# EAGLE design HH-08MX (EAGLE 7.5.0)
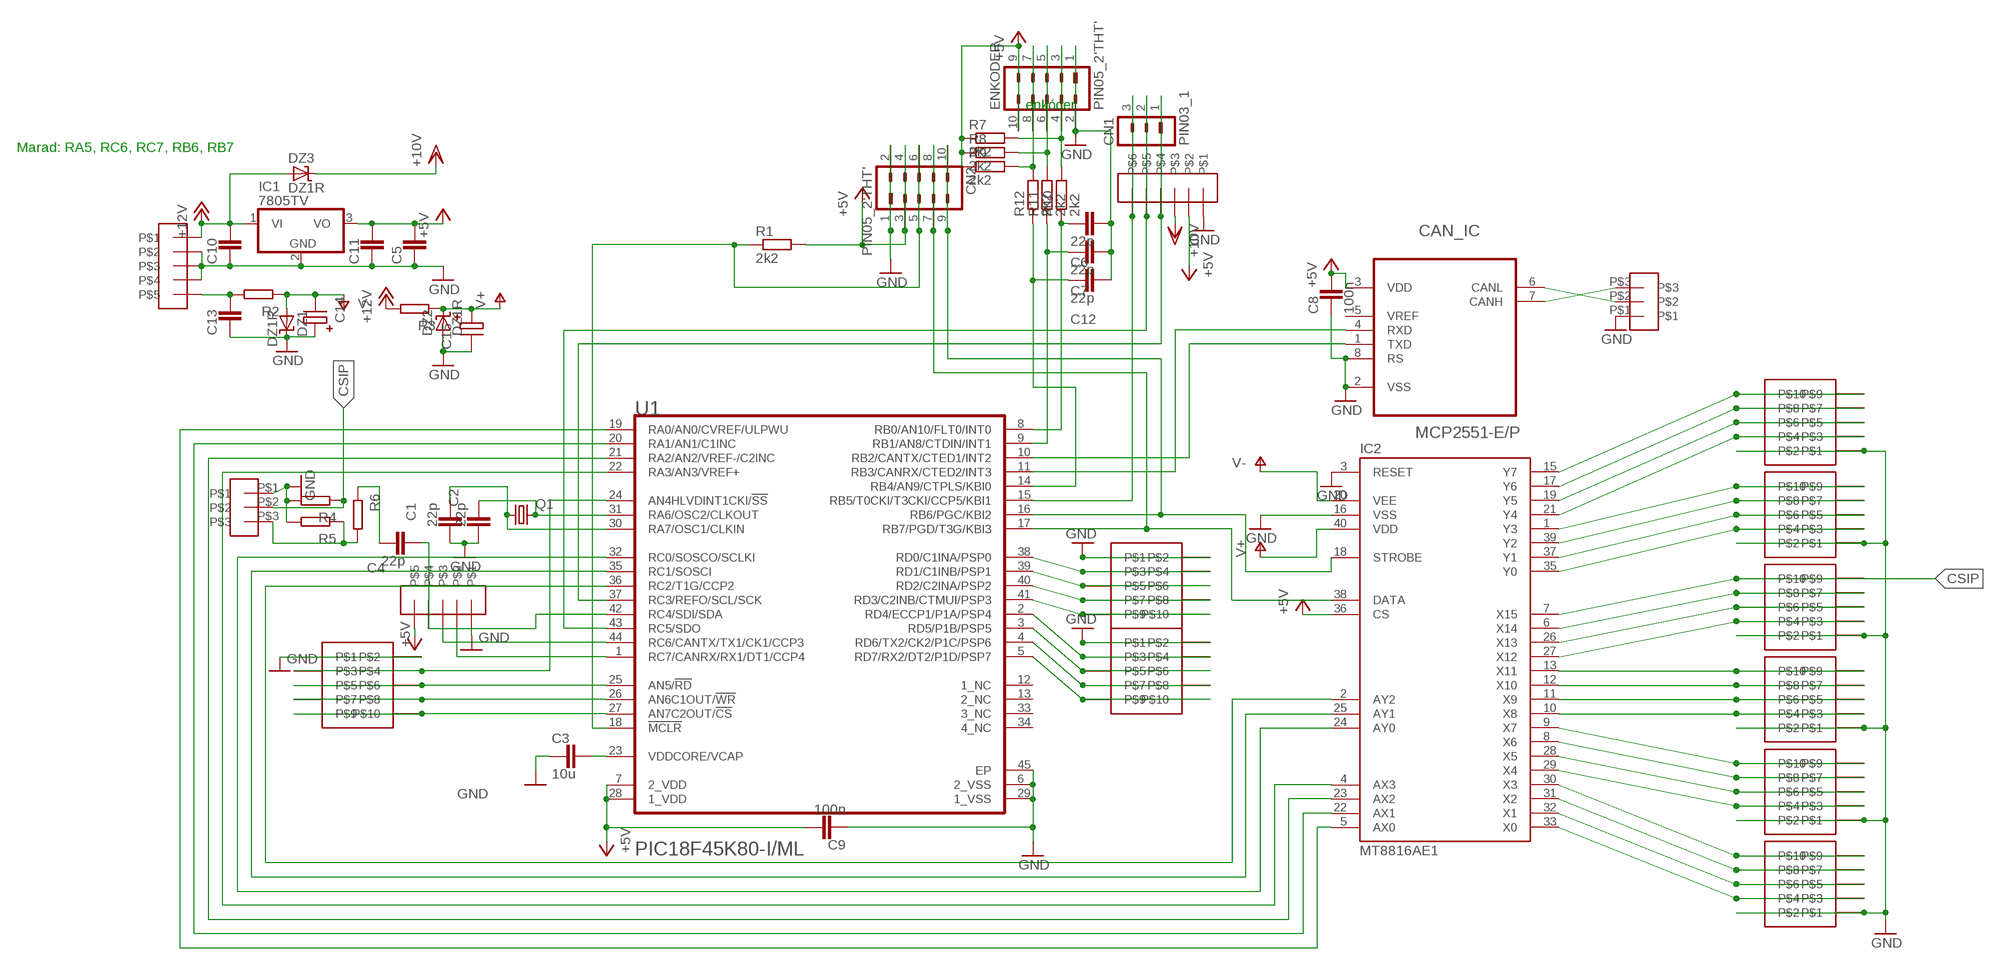
[diagram p0: schematic, sheet 1]

## Parts
BE1-4  KERETES_TUS_10  [KERETES_TUS_10]
BE5-8  KERETES_TUS_10  [KERETES_TUS_10]
BE9-12  KERETES_TUS_10  [KERETES_TUS_10]
BE13-16  KERETES_TUS_10  [KERETES_TUS_10]
C1  22p  C0805_NAGY  [R_0805_NAGY]
C2  22p  C0805_NAGY  [R_0805_NAGY]
C3  10u  C0805_NAGY  [R_0805_NAGY]
C4  22p  C0805_NAGY  [R_0805_NAGY]
C5  C0805_NAGY  [R_0805_NAGY]
C6  22p  C0805_NAGY  [R_0805_NAGY]
C7  22p  C0805_NAGY  [R_0805_NAGY]
C8  100n  C0805_NAGY  [R_0805_NAGY]
C9  100n  C0805_NAGY  [R_0805_NAGY]
C10  C0805_NAGY  [R_0805_NAGY]
C11  C0805_NAGY  [R_0805_NAGY]
C12  22p  C0805_NAGY  [R_0805_NAGY]
C13  C0805_NAGY  [R_0805_NAGY]
C14  C_EL1R06  [C_EL1RASZT06]
C15  C_EL1R06  [C_EL1RASZT06]
CAN_IC  MCP2551-E/P  [DIP254P762X432-8]
CN1  PIN03_1  [PIN03_1]
CN2  PIN05_2'THT'  [PIN05_2]
DZ1  DZ1R  [D1RASZT]
DZ2  DZ1R  [D1RASZT]
DZ3  DZ1R  [D1RASZT]
ENKODER  PIN05_2'THT'  [PIN05_2]
IC1  7805TV  [TO220V]
IC2  MT8816AE1  [DIL40]
KI1-4  KERETES_TUS_10  [KERETES_TUS_10]
KI5-8  KERETES_TUS_10  [KERETES_TUS_10]
KIJELZO  FEHER_TUS_6  [FEHER_TUS_6]
Q1  XTAL_2QS  [XTAL_QS]
R1  2k2  R-EU_R0805  [R0805]
R2  R_EU0805_NAGY  [R_0805_NAGY]
R3  R_EU0805_NAGY  [R_0805_NAGY]
R4  R_EU0805_NAGY  [R_0805_NAGY]
R5  R_EU0805_NAGY  [R_0805_NAGY]
R6  R_EU0805_NAGY  [R_0805_NAGY]
R7  2k2  R-EU_R0805  [R0805]
R8  2k2  R-EU_R0805  [R0805]
R9  2k2  R-EU_R0805  [R0805]
R10  2k2  R-EU_R0805  [R0805]
R11  2k2  R-EU_R0805  [R0805]
R12  2k2  R-EU_R0805  [R0805]
SOROSPORT  FEHER_TUS_5  [FEHER_TUS_5]
U1  MICROCHIP_PIC18F45K80-I-MLMICROCHIP_PIC18F45K80-I-ML_0_2  [MICROCHIP_PIC18F45K80-I-ML_2]
U$1  FEHER_TUS_3  [FEHER_TUS_3]
U$4  FEHER_TUS_3  [FEHER_TUS_3]
U$5  FEHER_TUS_5  [FEHER_TUS_5]
U$14  KERETES_TUS_10  [KERETES_TUS_10]
U$15  KERETES_TUS_10  [KERETES_TUS_10]
U$16  KERETES_TUS_10  [KERETES_TUS_10]

## Nets
+5V: C5.1 C8.1 C9.1 C11.1 CAN_IC.3(VDD) CN2.3 CN2.4 ENKODER.9 ENKODER.10 IC1.3(VO) IC2.36(CS) KIJELZO.P$2 R1.2 R7.1 R8.1 R9.1 SOROSPORT.P$5 U1.7(2_VDD) U1.28(1_VDD)
+12V: C10.1 DZ3.P$1(A) IC1.1(VI) R3.2(E) U$5.P$1
CSIP: BE13-16.P$9 BE13-16.P$10 IC2.7(X15) R4.1(A) U$1.P$2
GND: BE1-4.P$1 BE1-4.P$2 BE5-8.P$1 BE5-8.P$2 BE9-12.P$1 BE9-12.P$2 BE13-16.P$1 BE13-16.P$2 C1.1 C2.1 C3.2 C5.2 C6.1 C7.1 C8.2 C9.2 C10.2 C11.2 C12.1 C13.2 C14.P+ C15.P- CAN_IC.2(VSS) CAN_IC.8(RS) CN2.1 CN2.2 DZ1.P$2(C) DZ2.P$1(A) ENKODER.1 ENKODER.2 IC1.2(GND) IC2.3(RESET) IC2.16(VSS) KI1-4.P$1 KI1-4.P$2 KI5-8.P$1 KI5-8.P$2 KIJELZO.P$1 R4.2(E) R5.2(E) SOROSPORT.P$1 U1.6(2_VSS) U1.29(1_VSS) U1.45(EP) U$1.P$1 U$4.P$1 U$5.P$2 U$5.P$3 U$5.P$4 U$14.P$1 U$14.P$2 U$15.P$1 U$15.P$2 U$16.P$1 U$16.P$2
N$1: CN2.5 CN2.6 R1.1 U1.18(!MCLR!)
N$2: CN1.1 KIJELZO.P$4 U1.37(RC3/REFO/SCL/SCK)
N$3: CN2.9 CN2.10 IC2.18(STROBE) U1.16(RB6/PGC/KBI2)
N$4: C12.2 R12.1 U1.14(RB4/AN9/CTPLS/KBI0)
N$5: CAN_IC.1(TXD) U1.10(RB2/CANTX/CTED1/INT2)
N$6: C7.2 R11.1 U1.9(RB1/AN8/CTDIN/INT1)
N$7: CAN_IC.7(CANH) U$4.P$3
N$8: CAN_IC.6(CANL) U$4.P$2
N$9: IC2.15(Y7) KI5-8.P$9 KI5-8.P$10
N$10: C2.2 Q1.2 U1.31(RA6/OSC2/CLKOUT)
N$11: C1.2 Q1.1 U1.30(RA7/OSC1/CLKIN)
N$12: IC2.17(Y6) KI5-8.P$7 KI5-8.P$8
N$13: IC2.19(Y5) KI5-8.P$5 KI5-8.P$6
N$14: CAN_IC.4(RXD) U1.11(RB3/CANRX/CTED2/INT3)
N$15: C3.1 U1.23(VDDCORE/VCAP)
N$16: C6.2 R10.1 U1.8(RB0/AN10/FLT0/INT0)
N$17: IC2.21(Y4) KI5-8.P$3 KI5-8.P$4
N$18: CN1.2 KIJELZO.P$5 U1.43(RC5/SDO)
N$19: CN1.3 KIJELZO.P$6 U1.15(RB5/T0CKI/T3CKI/CCP5/KBI1)
N$20: U1.38(RD0/C1INA/PSP0) U$14.P$3 U$14.P$4
N$21: CN2.7 CN2.8 IC2.38(DATA) U1.17(RB7/PGD/T3G/KBI3)
N$22: U1.39(RD1/C1INB/PSP1) U$14.P$5 U$14.P$6
N$23: C13.1 R2.2(E) U$5.P$5
N$24: U1.40(RD2/C2INA/PSP2) U$14.P$7 U$14.P$8
N$25: U1.41(RD3/C2INB/CTMUI/PSP3) U$14.P$9 U$14.P$10
N$26: U1.2(RD4/ECCP1/P1A/PSP4) U$15.P$3 U$15.P$4
N$27: U1.3(RD5/P1B/PSP5) U$15.P$5 U$15.P$6
N$28: U1.4(RD6/TX2/CK2/P1C/PSP6) U$15.P$7 U$15.P$8
N$29: U1.5(RD7/RX2/DT2/P1D/PSP7) U$15.P$9 U$15.P$10
N$30: IC2.1(Y3) KI1-4.P$9 KI1-4.P$10
N$31: IC2.39(Y2) KI1-4.P$7 KI1-4.P$8
N$32: U1.27(AN7C2OUT/!CS!) U$16.P$9 U$16.P$10
N$33: U1.26(AN6C1OUT/!WR!) U$16.P$7 U$16.P$8
N$34: U1.25(AN5/!RD!) U$16.P$5 U$16.P$6
N$35: U1.24(AN4HLVDINT1CKI/!SS!) U$16.P$3 U$16.P$4
N$36: SOROSPORT.P$2 U1.1(RC7/CANRX/RX1/DT1/CCP4)
N$37: SOROSPORT.P$3 U1.44(RC6/CANTX/TX1/CK1/CCP3)
N$38: IC2.37(Y1) KI1-4.P$5 KI1-4.P$6
N$39: C4.1 SOROSPORT.P$4 U1.42(RC4/SDI/SDA)
N$40: IC2.35(Y0) KI1-4.P$3 KI1-4.P$4
N$41: ENKODER.5 ENKODER.6 R8.2 R11.2
N$42: BE13-16.P$7 BE13-16.P$8 IC2.6(X14)
N$43: BE13-16.P$5 BE13-16.P$6 IC2.26(X13)
N$44: BE13-16.P$3 BE13-16.P$4 IC2.27(X12)
N$45: BE9-12.P$9 BE9-12.P$10 IC2.13(X11)
N$46: BE9-12.P$7 BE9-12.P$8 IC2.12(X10)
N$47: BE9-12.P$5 BE9-12.P$6 IC2.11(X9)
N$48: BE9-12.P$3 BE9-12.P$4 IC2.10(X8)
N$49: BE5-8.P$9 BE5-8.P$10 IC2.9(X7)
N$50: BE5-8.P$7 BE5-8.P$8 IC2.8(X6)
N$51: BE5-8.P$5 BE5-8.P$6 IC2.28(X5)
N$52: BE5-8.P$3 BE5-8.P$4 IC2.29(X4)
N$53: BE1-4.P$9 BE1-4.P$10 IC2.30(X3)
N$54: BE1-4.P$7 BE1-4.P$8 IC2.31(X2)
N$55: BE1-4.P$5 BE1-4.P$6 IC2.32(X1)
N$56: BE1-4.P$3 BE1-4.P$4 IC2.33(X0)
N$57: ENKODER.7 ENKODER.8 R9.2 R12.2
N$58: R5.1(A) R6.2(E) U$1.P$3
N$59: C4.2 R6.1(A)
N$60: ENKODER.3 ENKODER.4 R7.2 R10.2
N$73: IC2.24(AY0) U1.32(RC0/SOSCO/SCLKI)
N$75: IC2.25(AY1) U1.35(RC1/SOSCI)
N$77: IC2.2(AY2) U1.36(RC2/T1G/CCP2)
N$83: IC2.4(AX3) U1.22(RA3/AN3/VREF+)
N$85: IC2.23(AX2) U1.21(RA2/AN2/VREF-/C2INC)
N$98: IC2.22(AX1) U1.20(RA1/AN1/C1INC)
N$99: IC2.5(AX0) U1.19(RA0/AN0/CVREF/ULPWU)
V+: C15.P+ DZ2.P$2(C) IC2.40(VDD) R3.1(A)
V-: C14.P- DZ1.P$1(A) IC2.20(VEE) R2.1(A)
VDD: DZ3.P$2(C) KIJELZO.P$3 ; supply symbol labelled +10V
Unconnected: CAN_IC.5(VREF) U1.12(1_NC) U1.13(2_NC) U1.33(3_NC) U1.34(4_NC)

## Notes on the sheet
- enkóder
- Marad: RA5, RC6, RC7, RB6, RB7

## Library data of the parts
BE1-4 BE5-8 BE9-12 BE13-16 KI1-4 KI5-8 U$14-U$16 = csatik:KERETES_TUS_10
C1-C13 = Cf_RLCPX:C
C14 C15 = Cf_RLCPX:C_EL
CAN_IC = Microchip_By_element14_Batch_1:MCP2551-E/P: High-Speed CAN Transceiver; MPN: MCP2551-E/P; OC_FARNELL: 1439745; OC_NEWARK: 69K7603; PACKAGE: DIP-8; SUPPLIER: Microchip
CN1 = Cf_Csatl:PIN03_1
CN2 ENKODER = Cf_Csatl:PIN05_2
DZ1-DZ3 = Cf_Felv:DZ
IC1 = Cf_Felv:78*: Positive VOLTAGE REGULATOR Source: http://cache.national.com/ds/LM/LM78L05.pdf http://www.fairchildsemi.com/ds/LM/LM7805.pdf
IC2 = MT8816:MT8816: 8x16 Analog Switch Array
KIJELZO = csatik:FEHER_TUS_6
Q1 = Cf_RLCPX:XTAL_2
R1 R7-R12 = rcl:R-EU_: RESISTOR, European symbol
R2-R6 = Cf_RLCPX:R_EU
SOROSPORT U$5 = csatik:FEHER_TUS_5
U1 = ML:MICROCHIP_PIC18F45K80-I-ML: MCHP-PIC18F45_46K80-QFN-44; CIIVA_IDS: 1156993; COMPONENT_LINK_2_DESCRIPTION: Package Specification; COMPONENT_LINK_2_URL: http://www.microchip.com/stellent/groups/techpub_sg/documents/packagingspec/en012702.pdf; COMPONENT_LINK_3_DESCRIPTION: URL Link1; COMPONENT_LINK_3_URL: Product URL:http://www.microchip.com/datasheet/PIC18F45K80; DATASHEET: http://ww1.microchip.com/downloads/en/DeviceDoc/39977f.pdf; DATASHEET_VERSION: Rev. F; DIGITAL_COMMUNICATION: 2 -A/E/USART, 1 -MSSP(SPI/I2C), 0 -SSP(SPI/I2C); EEPROM_DATA_MEMORY_BYTES: 1024; FOOTPRINT_VARIANT_NAME_0: Level C; FOOTPRINT_VARIANT_NAME_1: Level B; FOOTPRINT_VARIANT_NAME_2: Level A; IMPORTED: yes; IMPORTED_FROM: vault; IMPORT_TS: 1521864020; INTERNAL_OSCILLATOR: 16 MHz, 31 kHz; IO_PINS: 35; MAX_CPU_SPEED_MHZ: 64; MEMORY_TYPE: Flash; MF: Microchip; MOUNTING_TECHNOLOGY: Surface Mount; MPN: PIC18F45K80-I/ML; OF_AD_CHANNELS: 11; OPERATION_VOLTAGE_RANGE: 1.8V - 5.5V; PACKAGE: QFN-ML44; PACKAGE_DESCRIPTION: 44-Lead Plastic Quad Flat, 8 x 8 mm Body, 0.65 mm Pitch; PACKAGE_VERSION: C04-103C, 12/2012; PACKING: TUBE; PIN_0_0_14_INSIDE_EDGE: clock; PIN_0_0_15_INSIDE_EDGE: clock; PIN_0_0_23_INSIDE_EDGE: clock; PIN_0_0_29_INSIDE_EDGE: clock; PIN_0_0_31_INSIDE_EDGE: clock; PIN_0_0_36_INSIDE_EDGE: clock; PIN_0_0_3_INSIDE_EDGE: clock; PIN_0_0_43_INSIDE_EDGE: clock; PREFIX: U; PROGRAM_MEMORY_KBYTES: 32; PROGRAM_MEMORY_KWORDS: 16; RAM: 3648; RELEASE_DATE: 1370053096; ROHS: Yes; TIMERS: 2 - 8-bit, 3 - 16-bit; VAULT_GUID: CE6854A9-9697-4090-B66A-B438BDAAA53A; VAULT_REVISION: 9EEA89B8-936B-415F-BACD-3F90B382344D
U$1 U$4 = csatik:FEHER_TUS_3

## Net classes
0 default: width 0.203 mm, clearance 0.305 mm

## Board
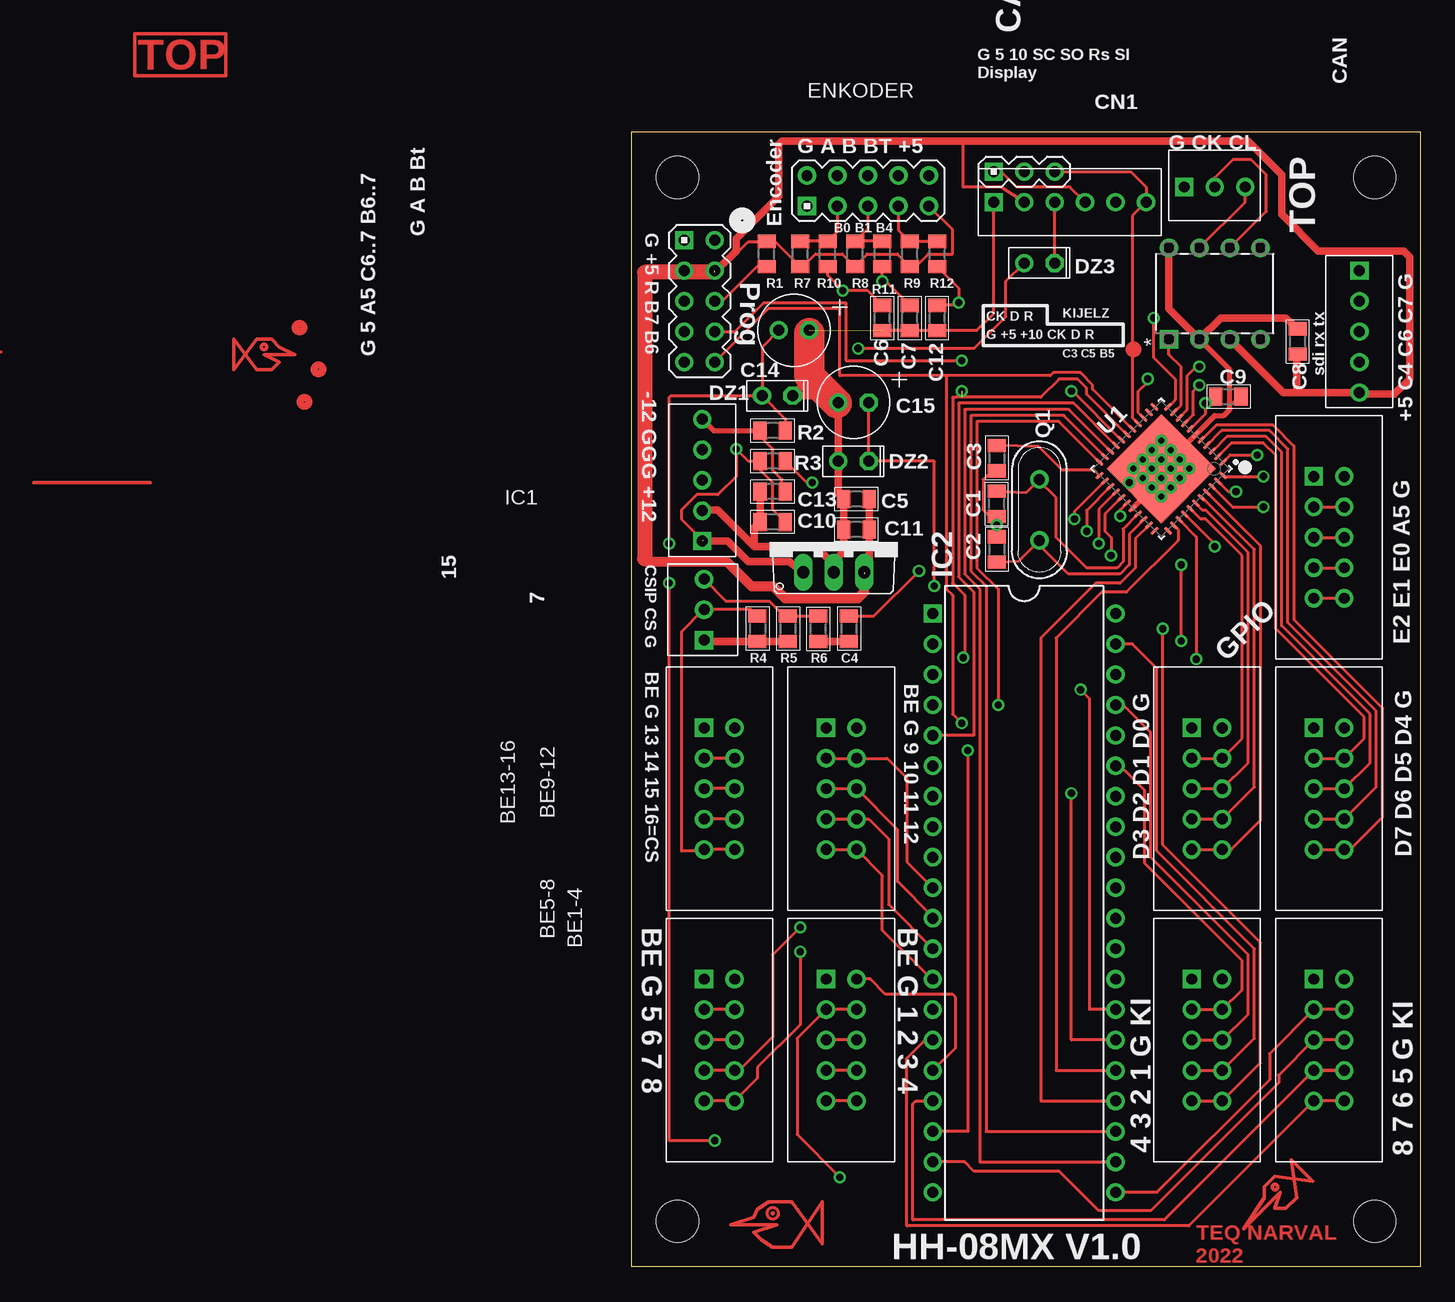
[diagram p1: board, top side]
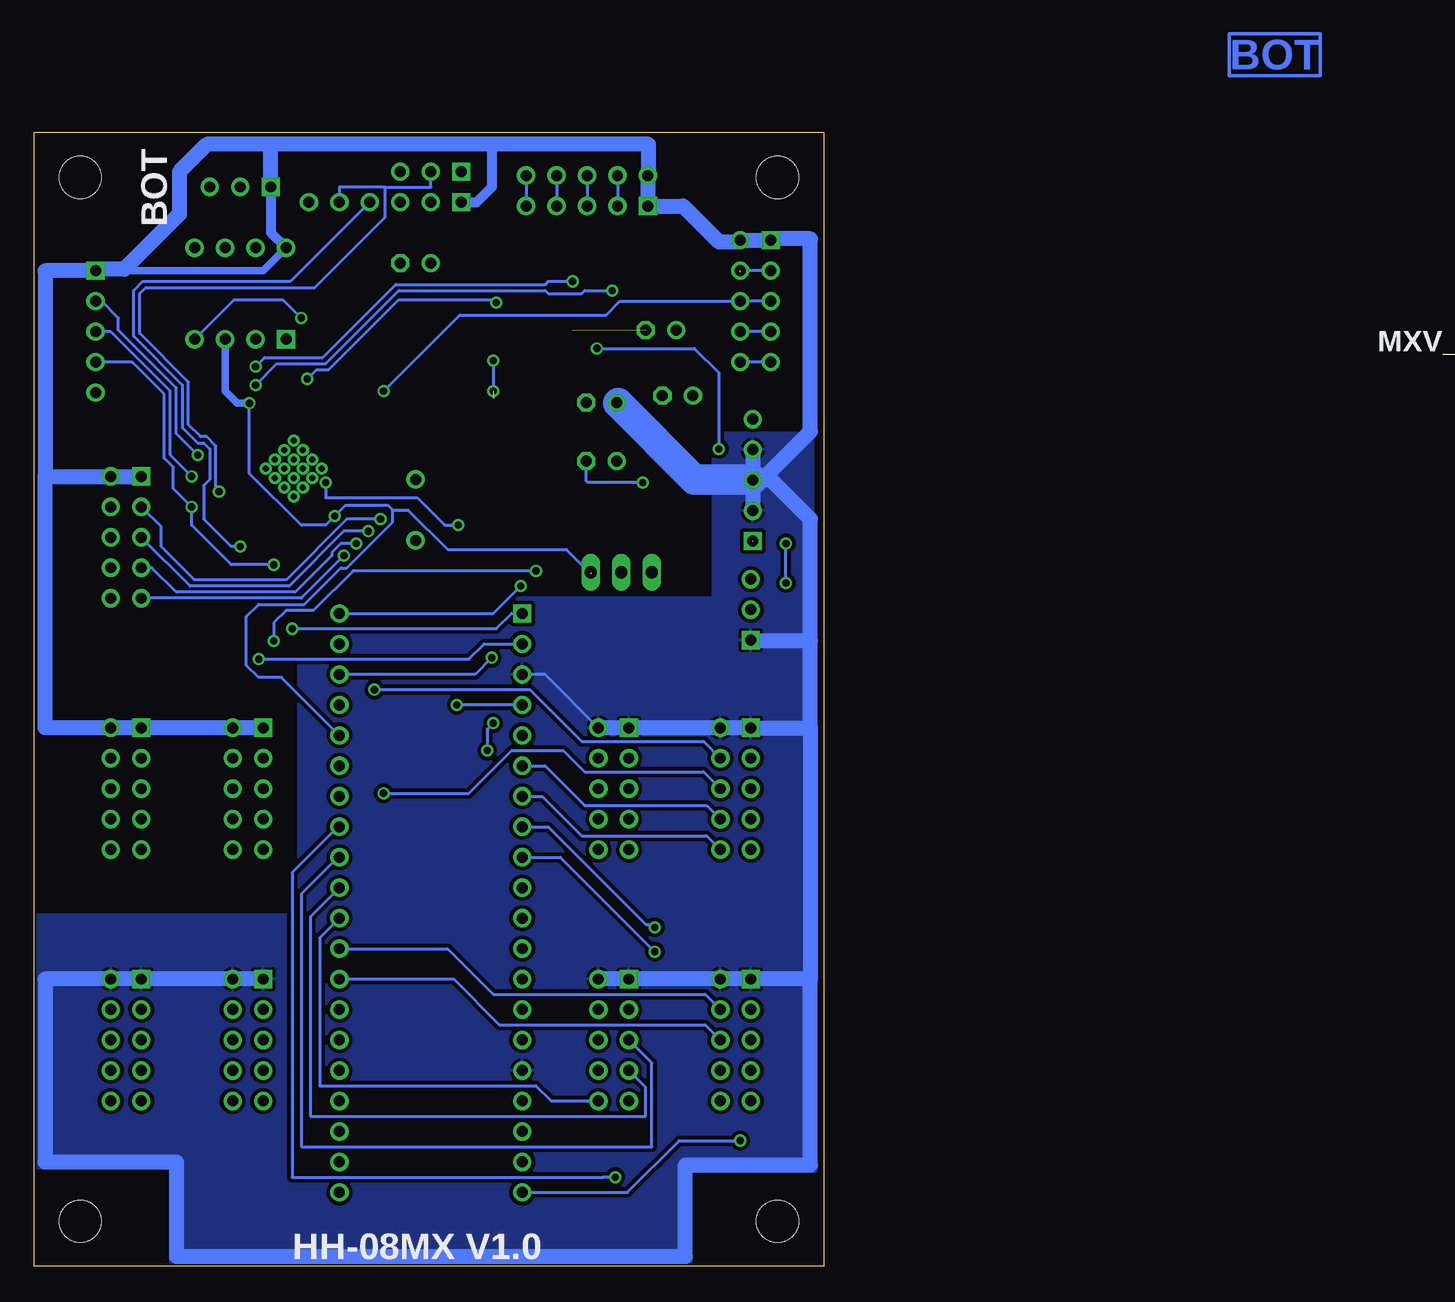
[diagram p2: board, bottom side, seen from below]

Size 65.81 x 94.52 mm. Coordinates in mm from the lower left corner, seen from the top.
Outline: 0,0 65.81,0 65.81,94.52 0,94.52 0,0
Copper layers (1*16): Top 0.035mm / dielectric 1.5mm / Bottom 0.035mm
Design rules "default *": minimum track width 8mil, minimum drill 20mil, track to track 8mil, track to pad 8mil, pad to pad 8mil, via to via 8mil, smd to smd 0mil, copper to edge 8mil, drill to drill 8mil, minimum pad ring 10mil, minimum via ring 8mil, stop-mask expansion 4mil, vias tented up to drill 0mil, thermal gap 10mil
Holes 3.5 mm at 61.95,90.78 3.86,90.78 61.95,3.75 3.86,3.75
tKeepout: area 60.2,89 to 63.7,92.5; area 2.1,89 to 5.6,92.5; area 60.2,2 to 63.7,5.5; area 2.1,2 to 5.6,5.5
bKeepout: area 60.2,89 to 63.7,92.5; area 2.1,89 to 5.6,92.5; area 60.2,2 to 63.7,5.5; area 2.1,2 to 5.6,5.5

### Footprints (pad centres in the part's own frame; a part is rotated, then mirrored left to right if it is on the bottom)
KERETES_TUS_10 = drill 0.914 pad 1.524 square: P$1 0,0 | drill 0.914 pad 1.524: P$2 0,2.54; P$3 2.54,0; P$4 2.54,2.54; P$5 5.08,0; P$6 5.08,2.54; P$7 7.62,0; P$8 7.62,2.54; P$9 10.16,0; P$10 10.16,2.54
R_0805_NAGY = smd 1.1 x 1.5: 1 -1.052,0; 2 1.052,0
C_EL1RASZT06 = drill 0.914 pad 1.524 octagon: P+ 1.27,0 | drill 0.914 pad 1.524: P- -1.27,0
DIP254P762X432-8 = drill 0.914 pad 1.524 square: 1 -3.81,3.81 | drill 0.914 pad 1.524: 2 -3.81,1.27; 3 -3.81,-1.27; 4 -3.81,-3.81; 5 3.81,-3.81; 6 3.81,-1.27; 7 3.81,1.27; 8 3.81,3.81
PIN03_1 = drill 0.914 pad 1.524 square: 1 -2.54,0 | drill 0.914 pad 1.524: 2 0,0; 3 2.54,0
PIN05_2 = drill 0.914 pad 1.524 square: 1 -5.08,0 | drill 0.914 pad 1.524: 2 -5.08,2.54; 3 -2.54,0; 4 -2.54,2.54; 5 0,0; 6 0,2.54; 7 2.54,0; 8 2.54,2.54; 9 5.08,0; 10 5.08,2.54
D1RASZT = drill 0.914 pad 1.524: P$1 -1.27,0 | drill 0.914 pad 1.524 octagon: P$2 1.27,0
TO220V = drill 1.016 long: 1 -2.54,-2.54; 2 0,-2.54; 3 2.54,-2.54
DIL40 = drill 0.914 pad 1.524 square: 1 -24.13,-7.62 | drill 0.914 pad 1.524: 2 -21.59,-7.62; 3 -19.05,-7.62; 4 -16.51,-7.62; 5 -13.97,-7.62; 6 -11.43,-7.62; 7 -8.89,-7.62; 8 -6.35,-7.62; 9 -3.81,-7.62; 10 -1.27,-7.62; 11 1.27,-7.62; 12 3.81,-7.62; 13 6.35,-7.62; 14 8.89,-7.62; 15 11.43,-7.62; 16 13.97,-7.62; 17 16.51,-7.62; 18 19.05,-7.62; 19 21.59,-7.62; 20 24.13,-7.62; 21 24.13,7.62; 22 21.59,7.62; 23 19.05,7.62; 24 16.51,7.62; 25 13.97,7.62; 26 11.43,7.62; 27 8.89,7.62; 28 6.35,7.62; 29 3.81,7.62; 30 1.27,7.62; 31 -1.27,7.62; 32 -3.81,7.62; 33 -6.35,7.62; 34 -8.89,7.62; 35 -11.43,7.62; 36 -13.97,7.62; 37 -16.51,7.62; 38 -19.05,7.62; 39 -21.59,7.62; 40 -24.13,7.62
FEHER_TUS_6 = drill 0.914 pad 1.524 square: P$1 7.62,0 | drill 0.914 pad 1.524: P$2 5.08,0; P$3 2.54,0; P$4 0,0; P$5 -2.54,0; P$6 -5.08,0
XTAL_QS = drill 0.914 pad 1.524: 1 -2.54,0; 2 2.54,0
R0805 = smd 1.1 x 1.5: 1 -1.05,0; 2 1.05,0
FEHER_TUS_5 = drill 0.914 pad 1.524 square: P$1 5.08,0 | drill 0.914 pad 1.524: P$2 2.54,0; P$3 0,0; P$4 -2.54,0; P$5 -5.08,0
MICROCHIP_PIC18F45K80-I-ML_2 = smd 0.8 x 0.3: 1 -4.05,3.25; 2 -4.05,2.6; 3 -4.05,1.95; 4 -4.05,1.3; 5 -4.05,0.65; 6 -4.05,0; 7 -4.05,-0.65; 8 -4.05,-1.3; 9 -4.05,-1.95; 10 -4.05,-2.6; 11 -4.05,-3.25; 23 4.05,-3.25; 24 4.05,-2.6; 25 4.05,-1.95; 26 4.05,-1.3; 27 4.05,-0.65; 28 4.05,0; 29 4.05,0.65; 30 4.05,1.3; 31 4.05,1.95; 32 4.05,2.6; 33 4.05,3.25 | smd 0.3 x 0.8: 12 -3.25,-4.05; 13 -2.6,-4.05; 14 -1.95,-4.05; 15 -1.3,-4.05; 16 -0.65,-4.05; 17 0,-4.05; 18 0.65,-4.05; 19 1.3,-4.05; 20 1.95,-4.05; 21 2.6,-4.05; 22 3.25,-4.05; 34 3.25,4.05; 35 2.6,4.05; 36 1.95,4.05; 37 1.3,4.05; 38 0.65,4.05; 39 0,4.05; 40 -0.65,4.05; 41 -1.3,4.05; 42 -1.95,4.05; 43 -2.6,4.05; 44 -3.25,4.05 | smd 6.43 x 6.43: 45 0,0 | drill 0.5: PAD_8 1.65,-1.65; PAD_9 0.55,-1.65; PAD_10 -0.55,-1.65; PAD_11 -1.65,-1.65; PAD_14 1.65,-0.55; PAD_15 0.55,-0.55; PAD_16 -0.55,-0.55; PAD_17 -1.65,-0.55; PAD_20 1.65,0.55; PAD_21 0.55,0.55; PAD_22 -0.55,0.55; PAD_23 -1.65,0.55; PAD_26 1.65,1.65; PAD_27 0.55,1.65; PAD_28 -0.55,1.65; PAD_29 -1.65,1.65
FEHER_TUS_3 = drill 0.914 pad 1.524 square: P$1 0,0 | drill 0.914 pad 1.524: P$2 2.54,0; P$3 5.08,0

### Placement (x,y rotation side)
BE1-4  16.24,23.94 270 top
BE5-8  6.08,23.94 270 top
BE9-12  16.24,44.9 270 top
BE13-16  6.08,44.9 270 top
C1  30.46,63.56 90 top
C2  30.46,59.75 270 top
C3  30.46,67.37 270 top
C4  18.14,53.15 270 top
C5  18.78,63.94 180 top
C6  20.94,79.06 90 top
C7  23.23,79.06 90 top
C8  55.55,77.09 90 top
C9  49.77,72.52 0 top
C10  11.79,62.04 180 top
C11  18.78,61.41 180 top
C12  25.51,79.06 90 top
C13  11.79,64.58 180 top
C14  13.57,78.04 0 top
C15  18.53,72.01 0 top
CAN_IC  48.62,81.09 90 top
CN1  32.75,91.25 0 top
CN2  4.43,80.45 270 top
DZ1  12.18,72.58 0 top
DZ2  18.53,67.12 0 top
DZ3  34.02,83.63 0 top
ENKODER  19.73,88.39 0 top
IC1  16.88,60.39 0 top
IC2  32.75,30.29 270 top
KI1-4  46.72,23.94 270 top
KI5-8  56.88,23.94 270 top
KIJELZO  37.83,88.71 180 top
Q1  34.02,63.06 270 top
R1  11.29,84.39 90 top
R2  11.79,69.66 180 top
R3  11.79,67.12 180 top
R4  10.53,53.15 270 top
R5  13.06,53.15 270 top
R6  15.6,53.15 90 top
R7  14.08,84.39 90 top
R8  18.65,84.39 90 top
R9  23.23,84.39 90 top
R10  16.37,84.39 90 top
R11  20.94,84.39 90 top
R12  25.51,84.39 90 top
SOROSPORT  60.69,77.92 90 top
U1  44.18,66.48 225 top
U$1  6.08,52.2 90 top
U$4  46.09,89.98 0 top
U$5  5.92,65.53 270 top
U$14  46.72,44.9 270 top
U$15  56.88,44.9 270 top
U$16  56.88,65.85 270 top

### Tracks (layer width: path | path; a pad name or v marks a point on that pad's centre or on a via)
+5V  (via drill 0.6)  (2 unrouted)
  Top 0.254: CN2.4 7.35,83 9.76,85.41 11.25,85.41 R1.2 11.98,85.44 R7.1 14.3,83.34 15.35,84.39 17.6,84.39 R8.1 18.65,83.38 19.67,84.39 22.18,84.39 R9.1 23.7,83.34 24.75,84.39 26.78,84.39 26.78,86.42 ENKODER.9 | U1.28 40.75,63.06 v40.75,62.55 | U1.7 47.86,71.09 v47.86,71.95 | KIJELZO.P$2 30.85,89.98 27.67,89.98 27.67,93.79
  Top 0.61: 6.97,82.87 8.75,84.65 8.75,85.66 12.3,89.22 12.3,93.54 12.56,93.79 27.67,93.79 51.42,93.79 54.21,91 54.21,87.69 57.26,84.65 64.37,84.65 64.88,84.14 64.88,73.98 63.61,72.71 60.82,72.71 SOROSPORT.P$5 55.48,72.83 | C9.1 48.24,71.95 v47.86,71.95 | CAN_IC.3 54.34,72.83 55.48,72.83 | C8.1 55.48,76.07 55.48,72.83 | IC1.3 19.83,58.01 C11.1 C5.1
  Top 0.813: 19.42,57.72 19.42,56.2 18.91,55.69 12.81,55.69 11.79,56.71 10.02,56.71 7.98,58.74 1.38,58.74 1.13,58.99
  Top 1.27: 6.97,82.87 1.13,82.87 1.13,58.99
  Bottom 0.254: ENKODER.10 ENKODER.9 | CN2.3 CN2.4 | IC2.36 45.2,49.09 47.1,49.09 48.12,50.1 48.12,54.17 47.1,55.18 43.29,55.18 40.24,58.23 39.73,58.23 35.93,62.04 35.93,63.06 | 35.93,63.06 36.31,63.44 39.86,63.44 v40.75,62.55 41.51,61.79 43.55,61.79 47.86,66.1 v47.86,71.95 | 35.93,63.06 34.66,63.06 31.35,59.75 21.45,59.75 19.42,57.72
  Bottom 0.61: v47.86,71.95 48.88,71.95 49.9,72.96 CAN_IC.3
+12V  (via drill 0.6)  (1 unrouted)
  Top 0.254: C10.1 11.79,63.09 11.79,65.34 10.74,66.39 R3.2 9.76,67.12 v8.75,68.14 8.75,65.85 7.22,64.33 5.45,64.33 4.17,63.06 4.17,62.29 5.95,60.52 | v18.91,76.52 28.56,76.52 31.23,79.19 31.23,82.11 DZ3.P$1
  Top 0.61: U$5.P$1 8.05,60.45 9.76,58.74 13.19,58.74 IC1.1
  Bottom 0.254: v18.91,76.52 10.78,76.52 8.75,74.49 v8.75,68.14
CSIP
  Top 0.254: R4.1 9.99,54.74 U$1.P$2 6.02,54.74 4.17,52.9 4.17,34.61 5.95,34.61 BE13-16.P$9 BE13-16.P$10
  Bottom 0.254: IC2.7 23.48,39.18 20.18,35.88 9.76,35.88 BE13-16.P$10
GND  (via drill 0.6)  (2 unrouted)
  Top 0.254: 44.18,65.57 U1.45 | C3.2 30.15,66.42 29.32,65.6 29.32,63.06 29.83,62.55 30.4,62.55 C1.1 v30.46,61.79 C2.1 | IC2.16 27.04,18.23 27.04,22.42 26.78,22.67 21.19,22.67 19.92,23.94 BE1-4.P$2 | U1.29 44.05,65.44 v41.51,65.34 | KIJELZO.P$1 30.21,79.44 28.81,78.04 25.55,78.04 C12.1 C7.1 C6.1
  Top 0.305: C9.2 50.15,71.95 49.9,71.95
  Top 0.406: U1.29 44.18,65.57 | U1.45 U1.6 48.62,70.93 49.39,70.93 49.9,71.44 49.9,71.95 49.9,74.74 CAN_IC.2
  Top 0.61: CAN_IC.8 44.81,79.82 CAN_IC.2 49.13,79.06 54.53,79.06 C8.2 | R5.2 R4.2 6.18,52.1 U$1.P$1 | IC1.2 16.88,58.48 16.75,58.61 | 16.75,58.61 15.35,60.01 10.27,60.01 | 10.27,60.01 7.22,63.06 5.98,63.06 U$5.P$2 | 10.27,60.01 10.27,61.57 C10.2 C13.2 | 16.75,58.61 17.73,59.59 C11.2 C5.2 17.26,64.42 DZ2.P$1 C15.P- 16.68,72.58 DZ1.P$2 14.84,73.98 14.84,77.79 C14.P+
  Top 2.54: 17.13,71.95 14.84,74.23 14.84,77.79
  Bottom 0.254: v41.51,65.34 41.51,64.07 33.89,64.07 31.61,61.79 v30.46,61.79 | BE9-12.P$2 23.23,49.34 IC2.3
  Bottom 0.61: SOROSPORT.P$1 46.72,83 CAN_IC.8
  Bottom 0.813: KIJELZO.P$1 28.94,88.71 27.67,89.98 27.67,93.16 | U$4.P$1 46.09,86.17 CAN_IC.8
  Bottom 1.27: U$14.P$1 U$14.P$2 U$15.P$1 U$15.P$2 64.88,44.9 64.88,65.85 | 64.88,65.85 U$16.P$2 U$16.P$1 | 64.88,65.85 64.88,83 SOROSPORT.P$1 60.56,83.12 58.28,83.12 53.7,87.69 53.7,91.25 51.42,93.54 46.09,93.54 | U$4.P$1 46.09,93.54 | 46.09,93.54 14.59,93.54 14.59,90.93 ENKODER.2 ENKODER.1 11.73,88.39 8.75,85.41 7.1,85.41 CN2.2 CN2.1 4.43,85.66 1.13,85.66 1.13,69.6 5.19,65.53 | U$5.P$4 U$5.P$3 | U$5.P$3 U$5.P$2 | KI1-4.P$1 KI1-4.P$2 KI5-8.P$1 KI5-8.P$2 64.88,23.94 64.88,8.7 53.96,8.7 53.96,0.83 11.54,0.83 11.54,8.45 1.13,8.45 1.13,23.94 | 1.13,23.94 BE5-8.P$1 BE5-8.P$2 BE1-4.P$1 BE1-4.P$2 | 1.13,44.9 1.13,23.94 | 1.13,44.9 BE13-16.P$1 BE13-16.P$2 BE9-12.P$1 BE9-12.P$2 | 1.13,44.9 1.13,52.13 | 1.13,52.13 6.08,52.13 U$1.P$1 | 1.13,52.13 1.13,62.29 4.37,65.53 U$5.P$3
  Bottom 2.54: 5.95,65.6 10.78,65.6 17.13,71.95
  pour Bottom: 0.87,69.41 9.25,69.41 9.25,55.69 43.8,55.69 43.8,29.27 65.64,29.27 65.64,8.19 54.47,8.19 54.47,0.32 11.03,0.32 11.03,7.94 0.62,7.94 0.62,14.29 0.87,14.29
HALACSKA1
  Top 0.305: 15.92,5.38 15.92,1.88 13.38,5.38 11.48,5.38 10.53,4.74 10.21,4.11 8.3,3.47 12.11,3.47 10.21,2.83 10.84,2.2 11.8,1.57 13.38,1.57 15.92,5.38
HALACSKA3
  Top 0.305: 55,8.87 56.79,7.07 53.65,7.52 52.75,6.62 52.75,5.72 51.05,3.12 54.1,6.17 53.65,4.82 54.55,4.82 55.45,5.72 55,8.87
HALACSKA4
  Top 0.305: -33.12,77.28 -33.12,74.74 -31.22,77.28 -29.95,77.28 -29.31,76.64 -28.04,76.01 -30.58,76.01 -29.31,75.37 -29.95,74.74 -31.22,74.74 -33.12,77.28
N$1  (via drill 0.6)
  Top 0.254: CN2.6 7.6,80.45 10.53,83.38 11.25,83.38 R1.1 | U1.18 36.78,72.96 v36.69,72.96
  Bottom 0.254: CN2.5 CN2.6 17,80.45 18.14,79.31 30.34,79.31 v36.69,72.96
N$2  (via drill 0.6)
  Top 0.254: U1.37 48.62,60.2 v48.62,60.01 | KIJELZO.P$4 36.56,89.98 32.12,89.98 30.85,91.25 CN1.1
  Bottom 0.254: v48.62,60.01 49.39,60.01 51.67,62.29 51.67,65.09 51.16,65.6 51.16,68.14 51.67,68.64 52.18,68.64 53.45,69.91 53.45,73.47 57.52,77.53 57.52,81.34 56.75,82.11 44.43,82.11 KIJELZO.P$4
N$3  (via drill 0.6)
  Top 0.254: U1.16 38.47,73.12 38.47,73.47 37.45,74.49 35.16,74.49 34.91,74.23 26.27,74.23 | 26.27,74.23 26.27,56.45 26.78,55.94 26.78,46.04 v27.54,45.28 | v28.05,42.99 28.05,11.24 IC2.18 | 26.27,74.23 17.38,74.23 17.38,79.82 11.41,79.82 CN2.10
  Bottom 0.254: CN2.9 CN2.10 | v27.54,45.28 28.05,44.77 v28.05,42.99
N$4  (via drill 0.6)
  Top 0.254: U1.14 42.27,71.15 42.27,72.96 43.04,73.72 v43.04,73.98 | C12.2 27.07,80.11 v27.29,80.33 27.29,81.56 R12.1
  Bottom 0.254: v43.04,73.98 42.27,74.74 41.26,74.74 35.42,80.58 27.54,80.58 v27.29,80.33
N$5
  Top 0.254: U1.10 45.83,71.81 45.83,74.99 44.81,76.01 CAN_IC.1
N$6  (via drill 0.6)
  Top 0.254: U1.9 46.34,71.4 46.34,74.23 47.1,74.99 v47.36,74.99 | R11.1 v20.94,82.11 21.23,82.11 C7.2
  Bottom 0.254: v47.36,74.99 46.59,75.76 41.77,75.76 35.67,81.85 23.23,81.85 22.97,82.11 v20.94,82.11
N$7
  Top 0.254: CAN_IC.7 51.16,88.71 U$4.P$3
N$8
  Top 0.254: CAN_IC.6 52.94,87.95 52.94,91 51.67,92.27 50.15,92.27 48.62,90.74 U$4.P$2
N$9
  Top 0.254: KI5-8.P$10 KI5-8.P$9 46.47,3.37 22.97,3.37 22.97,17.34 24.5,18.86 IC2.15
N$10
  Top 0.254: U1.31 41.51,61.06 41.51,58.48 40.75,57.72 36.43,57.72 34.02,60.14 Q1.2 32.31,58.8 C2.2
N$11
  Top 0.254: U1.30 41.01,61.47 41.01,58.74 40.5,58.23 37.96,58.23 35.42,60.77 35.42,64.07 34.02,65.47 Q1.1 32.94,64.52 C1.2
N$12
  Top 0.254: KI5-8.P$8 KI5-8.P$7 | KI5-8.P$7 59.55,16.32 | KI5-8.P$7 44.43,3.87 23.48,3.87 23.48,13.53 23.73,13.78 IC2.17
N$13
  Top 0.254: IC2.19 27.8,8.7 28.56,7.94 35.67,7.94 38.97,4.64 43.29,4.64 53.96,15.3 53.96,15.94 KI5-8.P$5 KI5-8.P$6
N$14  (via drill 0.6)
  Top 0.254: U1.11 45.32,72.22 45.32,73.98 43.55,75.76 v43.55,79.06
  Bottom 0.254: CAN_IC.4 49.13,80.58 45.07,80.58 43.93,79.44 v43.55,79.06
N$15
  Top 0.254: U1.23 38.58,66.36 35.93,66.36 33.96,68.33 C3.1
N$16  (via drill 0.6)
  Top 0.254: U1.8 46.85,70.99 46.85,72.96 v47.36,73.47 | R10.1 16.37,82.61 v17.64,81.34 19.71,81.34 C6.2
  Bottom 0.254: v47.36,73.47 45.58,75.25 41.51,75.25 35.42,81.34 23.23,81.34 22.97,81.09 20.18,81.09 19.92,81.34 v17.64,81.34
N$17
  Top 0.254: IC2.21 43.8,6.16 53.2,15.56 53.2,17.72 KI5-8.P$3 KI5-8.P$4
N$18  (via drill 0.6)
  Top 0.254: U1.43 49.76,64.58 v50.4,64.58
  Bottom 0.254: v50.4,64.58 50.66,64.83 50.66,68.39 51.42,69.15 51.93,69.15 52.94,70.17 52.94,73.72 57.01,77.79 57.01,81.09 56.5,81.6 42.4,81.6 36.56,87.44 36.56,89.98 | 36.56,89.98 40.37,89.98 KIJELZO.P$5 | 36.56,89.98 32.75,89.98 CN1.2
N$19
  Top 0.254: U1.15 41.77,70.74 41.77,87.57 KIJELZO.P$6 42.91,89.98 41.64,91.25 CN1.3
N$20
  Top 0.254: U1.38 47.45,62.29 47.86,62.29 50.91,59.25 50.91,44.01 U$14.P$4 U$14.P$3
N$21  (via drill 0.6)  (1 unrouted)
  Top 0.254: U1.17 37.96,72.71 37.96,73.22 37.2,73.98 35.67,73.98 34.15,72.45 27.04,72.45 | v27.67,50.74 27.67,50.99 27.8,51.12 27.8,55.94 26.78,56.96 26.78,72.45 27.04,72.45 | CN2.8 8.62,77.92 11.03,80.33 17.89,80.33 17.89,75.5 v27.54,75.5 | 27.04,72.45 v27.54,72.96
  Bottom 0.254: CN2.7 CN2.8 | v27.67,50.74 29.07,49.34 IC2.38 | v27.54,75.5 27.54,72.45
N$22
  Top 0.254: U1.39 47.61,63.06 47.86,63.06 51.42,59.5 51.42,41.97 U$14.P$6 U$14.P$5
N$23
  Top 0.254: C13.1 12.56,64.87 12.56,65.6 11.79,66.36 11.79,68.14 10.74,69.19 R2.2
  Top 0.406: U$5.P$5 6.87,69.66 R2.2
N$24
  Top 0.254: U1.40 47.6,64.08 51.93,59.75 51.93,39.94 U$14.P$8 U$14.P$7
N$25
  Top 0.254: U1.41 52.44,60.07 52.44,37.15 50.02,34.73 U$14.P$10 U$14.P$9
N$26
  Top 0.254: U1.2 50.02,68.64 52.69,68.64 53.7,67.63 53.7,53.15 61.07,45.78 61.07,44.01 U$15.P$4 U$15.P$3
N$27
  Top 0.254: U1.3 48.46,67.97 49.64,69.15 52.94,69.15 54.21,67.88 54.21,53.4 61.58,46.04 61.58,41.97 U$15.P$6 U$15.P$5
N$28
  Top 0.254: U1.4 49.19,69.66 53.2,69.66 54.72,68.14 54.72,53.66 62.09,46.29 62.09,39.94 U$15.P$8 U$15.P$7
N$29
  Top 0.254: U1.5 48.78,70.17 53.45,70.17 55.23,68.39 55.23,53.91 62.59,46.55 62.59,37.4 59.93,34.73 U$15.P$10 U$15.P$9
N$30  (via drill 0.6)
  Top 0.254: v44.31,53.15 44.31,35.12 52.44,26.99 52.44,16.95 KI1-4.P$10 KI1-4.P$9
  Bottom 0.254: v44.31,53.15 27.29,53.15 26.02,54.42 IC2.1
N$31
  Top 0.254: IC2.39 41.77,51.88 43.8,49.85 43.8,34.61 51.93,26.48 51.93,18.99 KI1-4.P$8 KI1-4.P$7
N$32  (via drill 0.6)
  Top 0.254: U1.27 39.48,62.7 39.48,61.28 39.99,60.77 v39.99,59.25 | U$16.P$9 U$16.P$10
  Bottom 0.254: v39.99,59.25 43.55,55.69 U$16.P$9
N$33  (via drill 0.6)
  Top 0.254: U1.26 38.97,63.12 v38.97,60.26 | U$16.P$7 U$16.P$8
  Bottom 0.254: v38.97,60.26 40.24,60.26 41.01,59.5 41.01,59.25 44.05,56.2 53.96,56.2 55.99,58.23 U$16.P$7
N$34  (via drill 0.6)
  Top 0.254: U1.25 37.96,63.02 v37.96,61.28 | U$16.P$5 U$16.P$6
  Bottom 0.254: v37.96,61.28 39.99,61.28 44.56,56.71 52.82,56.71 U$16.P$5
N$35  (via drill 0.6)
  Top 0.254: U1.24 36.94,62.92 v36.94,62.29 | U$16.P$3 U$16.P$4
  Bottom 0.254: v36.94,62.29 39.73,62.29 44.81,57.21 52.44,57.21 55.23,60.01 55.23,61.66 U$16.P$3
N$36  (via drill 0.6)
  Top 0.254: U1.1 49.92,67.63 v52.18,67.63
  Bottom 0.254: v52.18,67.63 53.96,69.41 53.96,73.22 58.79,78.04 58.79,79.06 60.18,80.45 SOROSPORT.P$2
N$37  (via drill 0.6)
  Top 0.254: U1.44 49.41,65.85 v52.69,65.85
  Bottom 0.254: v52.69,65.85 54.47,67.63 54.47,72.96 59.42,77.92 SOROSPORT.P$3
N$38
  Top 0.254: IC2.37 41.01,46.8 43.29,44.51 43.29,34.1 51.42,25.97 51.42,21.02 KI1-4.P$6 KI1-4.P$5
N$39  (via drill 0.6)
  Top 0.254: U1.42 50.11,63.31 v52.69,63.31 | 60.44,75.38 SOROSPORT.P$4 | C4.1 20.21,54.2 v23.99,57.98 | v45.83,52.13 v45.83,58.48
  Bottom 0.254: SOROSPORT.P$4 57.64,75.38 54.98,72.71 54.98,67.37 54.21,66.61 54.21,64.83 v52.69,63.31 52.69,61.79 49.39,58.48 v45.83,58.48 | v23.99,57.98 39.23,57.98 42.53,54.67 44.81,54.67 45.83,53.66 v45.83,52.13
N$40
  Top 0.254: IC2.35 40.75,41.72 42.78,39.69 42.78,33.59 50.91,25.46 50.91,23.05 KI1-4.P$4 KI1-4.P$3
N$41
  Top 0.254: ENKODER.5 19.73,86.52 R8.2 R11.2
  Bottom 0.254: ENKODER.6 ENKODER.5
N$42
  Top 0.254: BE13-16.P$8 BE13-16.P$7
  Bottom 0.254: IC2.6 23.23,41.72 19.92,38.42 9.76,38.42 BE13-16.P$8
N$43  (via drill 0.6)
  Top 0.254: IC2.26 36.69,18.86 v36.69,39.43 | BE13-16.P$6 BE13-16.P$5
  Bottom 0.254: v36.69,39.43 29.58,39.43 26.02,42.99 21.7,42.99 19.92,41.21 10.02,41.21 BE13-16.P$6
N$44  (via drill 0.6)
  Top 0.254: IC2.27 38.21,21.4 38.21,47.31 v37.45,48.07 | BE13-16.P$4 BE13-16.P$3
  Bottom 0.254: v37.45,48.07 24.5,48.07 20.18,43.75 10.02,43.75 BE13-16.P$4
N$45
  Top 0.254: IC2.13 25,23.94 20.94,28 20.94,32.58 BE9-12.P$10 BE9-12.P$9
N$46
  Top 0.254: IC2.12 21.45,30.16 21.45,35.62 19.8,37.27 BE9-12.P$8 BE9-12.P$7
N$47
  Top 0.254: IC2.11 25.13,29.15 22.21,32.07 22.21,36.39 BE9-12.P$6 BE9-12.P$5
N$48
  Top 0.254: IC2.10 22.97,33.72 22.97,40.7 21.32,42.35 BE9-12.P$4 BE9-12.P$3
N$49  (via drill 0.6)
  Top 0.254: v14.08,26.23 14.08,20.13 10.53,16.57 10.53,15.68 BE5-8.P$10 BE5-8.P$9
  Bottom 0.254: IC2.9 21.96,34.1 v14.08,26.23
N$50  (via drill 0.6)
  Top 0.254: v14.08,28.26 11.79,25.97 11.79,19.11 9,16.32 BE5-8.P$8 BE5-8.P$7
  Bottom 0.254: IC2.8 22.97,36.64 14.84,28.51 14.33,28.51 v14.08,28.26
N$51
  Top 0.254: BE5-8.P$6 BE5-8.P$5
  Bottom 0.254: IC2.28 30.85,23.94 27.04,20.13 9.89,20.13 BE5-8.P$6
N$52
  Top 0.254: BE5-8.P$4 BE5-8.P$3
  Bottom 0.254: IC2.29 31.35,26.48 27.54,22.67 9.89,22.67 BE5-8.P$4
N$53
  Top 0.254: BE1-4.P$10 BE1-4.P$9
  Bottom 0.254: IC2.30 42.02,27.37 42.02,15.05 23.99,15.05 22.72,13.78 BE1-4.P$10
N$54
  Top 0.254: BE1-4.P$8 BE1-4.P$7
  Bottom 0.254: IC2.31 42.78,29.15 42.78,12.51 14.84,12.51 14.84,14.92 BE1-4.P$7
N$55
  Top 0.254: BE1-4.P$6 BE1-4.P$5
  Bottom 0.254: IC2.32 40.5,34.1 43.55,31.05 43.55,9.97 14.33,9.97 14.33,16.95 BE1-4.P$5
N$56  (via drill 0.6)
  Top 0.254: v17.38,7.43 13.83,10.99 13.83,18.99 BE1-4.P$3 BE1-4.P$4
  Bottom 0.254: IC2.33 40.5,36.64 44.31,32.83 44.31,7.43 18.4,7.43 v17.38,7.43
N$57
  Top 0.254: ENKODER.7 22.27,86.39 R9.2 R12.2
  Bottom 0.254: ENKODER.8 ENKODER.7
N$58
  Top 0.254: R6.2 R5.1 12.77,54.2 11.54,55.44 7.92,55.44 U$1.P$3
N$59
  Top 0.61: C4.2 R6.1
N$60
  Top 0.254: ENKODER.3 17.19,86.27 R10.2 R7.2
  Bottom 0.254: ENKODER.4 ENKODER.3
N$73
  Top 0.254: U1.32 42.02,60.65 42.02,58.23 40.75,56.96 38.72,56.96 34.15,52.39 34.15,13.78 IC2.24
N$75
  Top 0.254: U1.35 45.58,61.41 45.58,60.52 41.26,56.2 39.23,56.2 35.42,52.39 35.42,16.32 IC2.25
N$77  (via drill 0.6)
  Top 0.254: U1.36 47.1,60.81 v47.1,50.61
  Bottom 0.254: v47.1,50.61 29.58,50.61 28.3,51.88 IC2.2
N$81
  Bottom 0.305: -41.39,99.27 -33.77,99.27 -33.77,102.76 -41.39,102.76 -41.39,99.27
N$83  (via drill 0.6)
  Top 0.254: U1.22 35.65,70.42 28.81,70.42 28.81,58.23 30.59,56.45 v30.59,46.8
  Bottom 0.254: IC2.4 v30.59,46.8
N$85
  Top 0.254: U1.21 36.06,70.93 28.3,70.93 28.3,57.98 29.58,56.71 29.58,11.24 IC2.23
N$98
  Top 0.254: U1.20 36.47,71.44 27.8,71.44 27.8,57.72 29.07,56.45 29.07,8.7 IC2.22
N$99
  Top 0.254: U1.19 36.88,71.95 27.29,71.95 27.29,57.47 28.56,56.2 28.56,44.26 IC2.5
N$102
  Top 0.305: -33.77,99.27 -41.39,99.27 -41.39,102.76 -33.77,102.76 -33.77,99.27
N$TEQV2
  Top 0.305: -49.79,65.34 -40.1,65.34
V+  (via drill 0.6)
  Top 0.254: v25.26,56.71 25.26,67.12 DZ2.P$2 C15.P+ | R3.1 14.62,65.34 v15.1,65.34
  Bottom 0.254: IC2.40 27.54,54.42 v25.26,56.71 | v15.1,65.34 19.67,65.34 19.8,65.47 DZ2.P$2
V-  (via drill 0.6)
  Top 0.254: v6.97,10.48 3.16,10.48 v3.16,56.96 | v3.16,60.26 3.16,72.45 3.29,72.58 DZ1.P$1 | DZ1.P$1 12.85,70.64 R2.1 | C14.P- 10.91,76.64 DZ1.P$1
  Bottom 0.254: IC2.20 16.37,6.16 12.05,10.48 v6.97,10.48 | v3.16,56.96 v3.16,60.26
VDD
  Top 0.254: DZ3.P$2 KIJELZO.P$3
(copper drawn outside any net)
  shapes: Top circle x8

### Text on the board
Top: TOP | MXV_16-8 V1.1 | TEQ NARVAL / 2022
Bottom: BOT
bPlace: MXV_16-8 V1.1
tNames: G 5 10 SC SO Rs SI / Display | CAN | 470 120 | G A B BT +5 | G CK CL | Encoder | G A B Bt | G +5 R B7 B6 | B0 B1 B4 | TOP | Prog | CK D R | KIJELZ | G +5 +10 CK D R | G 5 A5 C6..7 B6..7 | C3 C5 B5 | sdi rx tx | -12 GGG +12 | -5 G G 12 5 | +5 C4 C6 C7 G | CSIP CS G | 15 | 7 | E2 E1 E0 A5 G | BE G 13 14 15 16=CS | GPIO | BE G 9 10 11 12 | D3 D2 D1 D0 G | D7 D6 D5 D4 G | BE G 5 6 7 8 | BE G 1 2 3 4 | 4 3 2 1 G KI | 8 7 6 5 G KI | HH-08MX V1.0
bNames: BOT | HH-08MX V1.0